# EasyEDA schematic SCH_FC-Hilsha_2025-08-06.json

## Sheets
1 2_XRACER-IMU-R07.schdoc
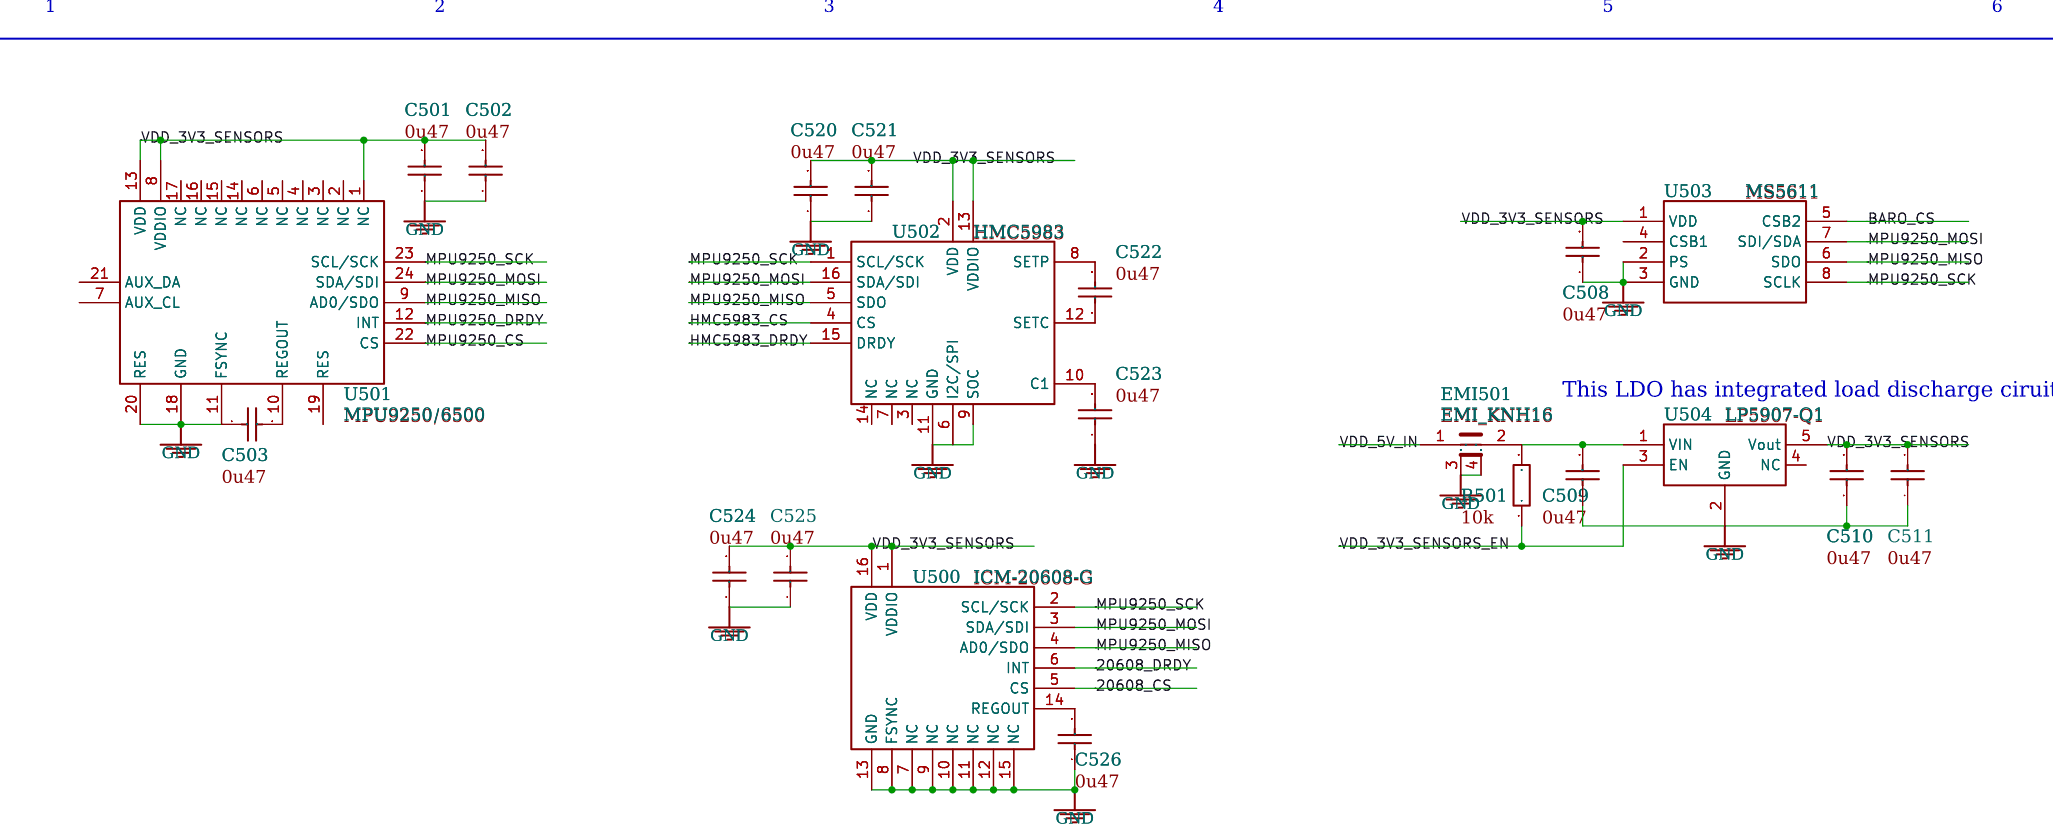
[diagram p0: 2_XRACER-IMU-R07.schdoc]
2 FC Hilsha/XRACER-FMU-R07/XRACER-FMU-R07/1_XRACER-FMU-R07.schdoc
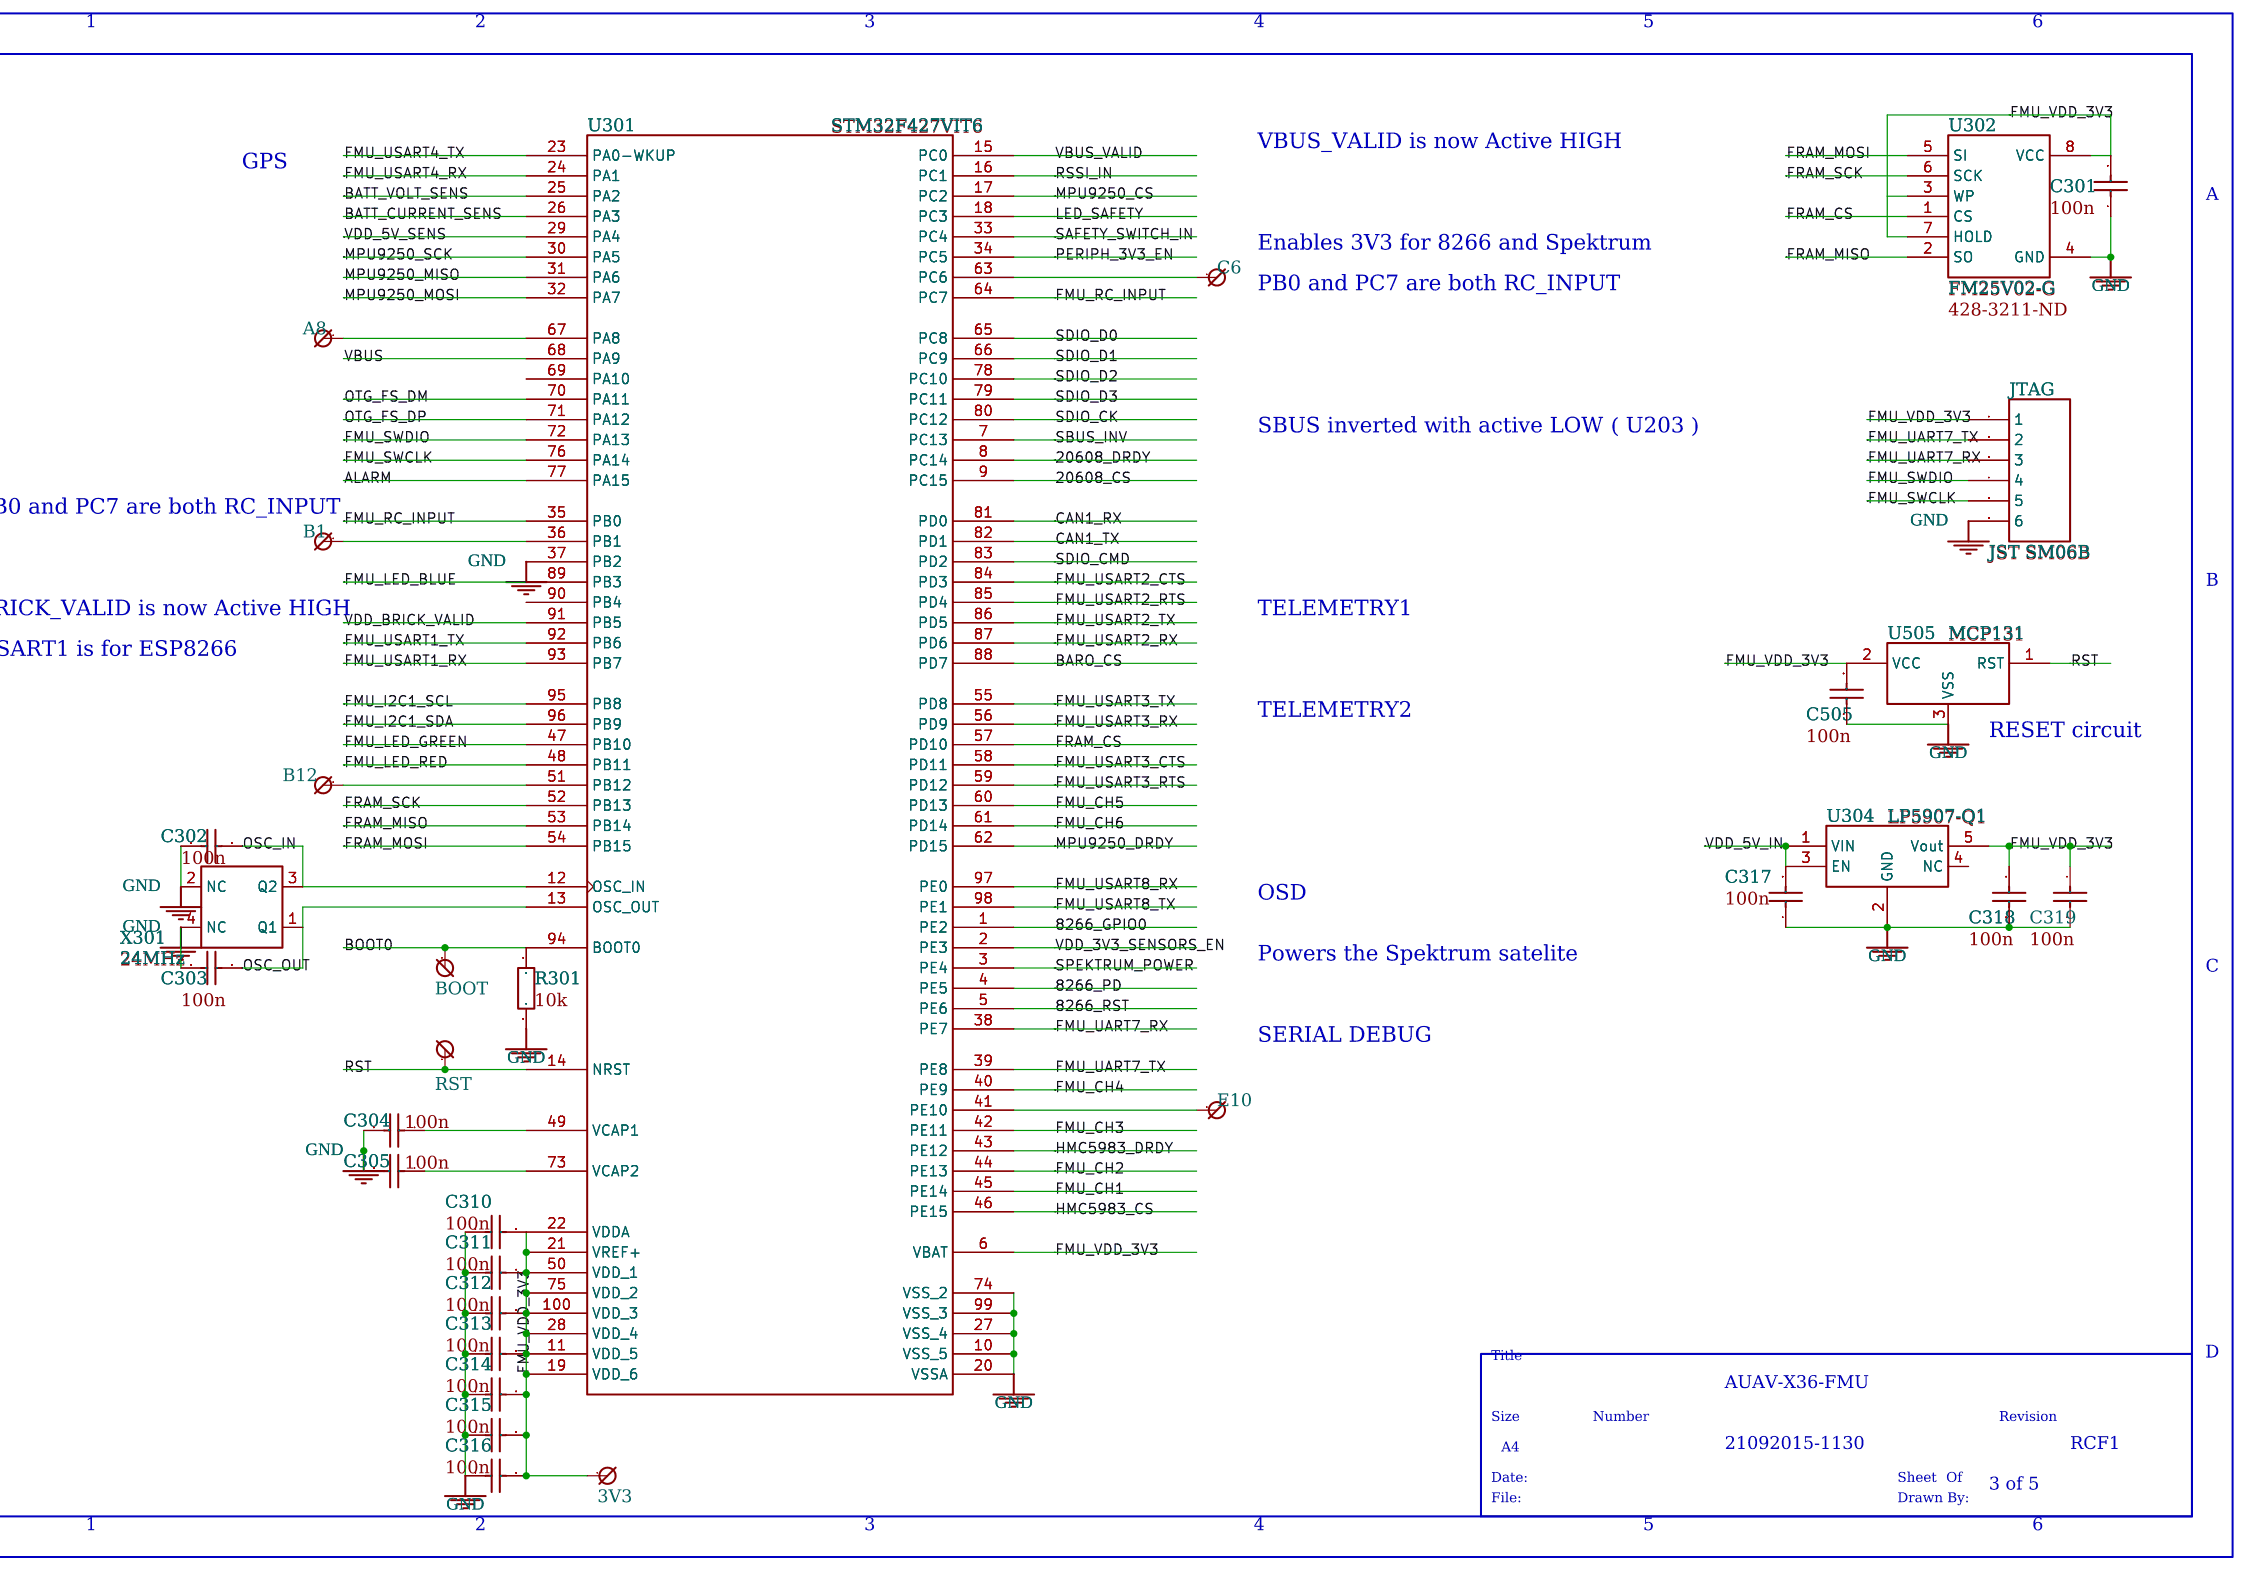
[diagram p1: FC Hilsha/XRACER-FMU-R07/XRACER-FMU-R07/1_XRACER-FMU-R07.schdoc]
3 FC Hilsha/XRACER-FMU-R07/XRACER-FMU-R07/3_XRACER-POWER-R07.schdoc
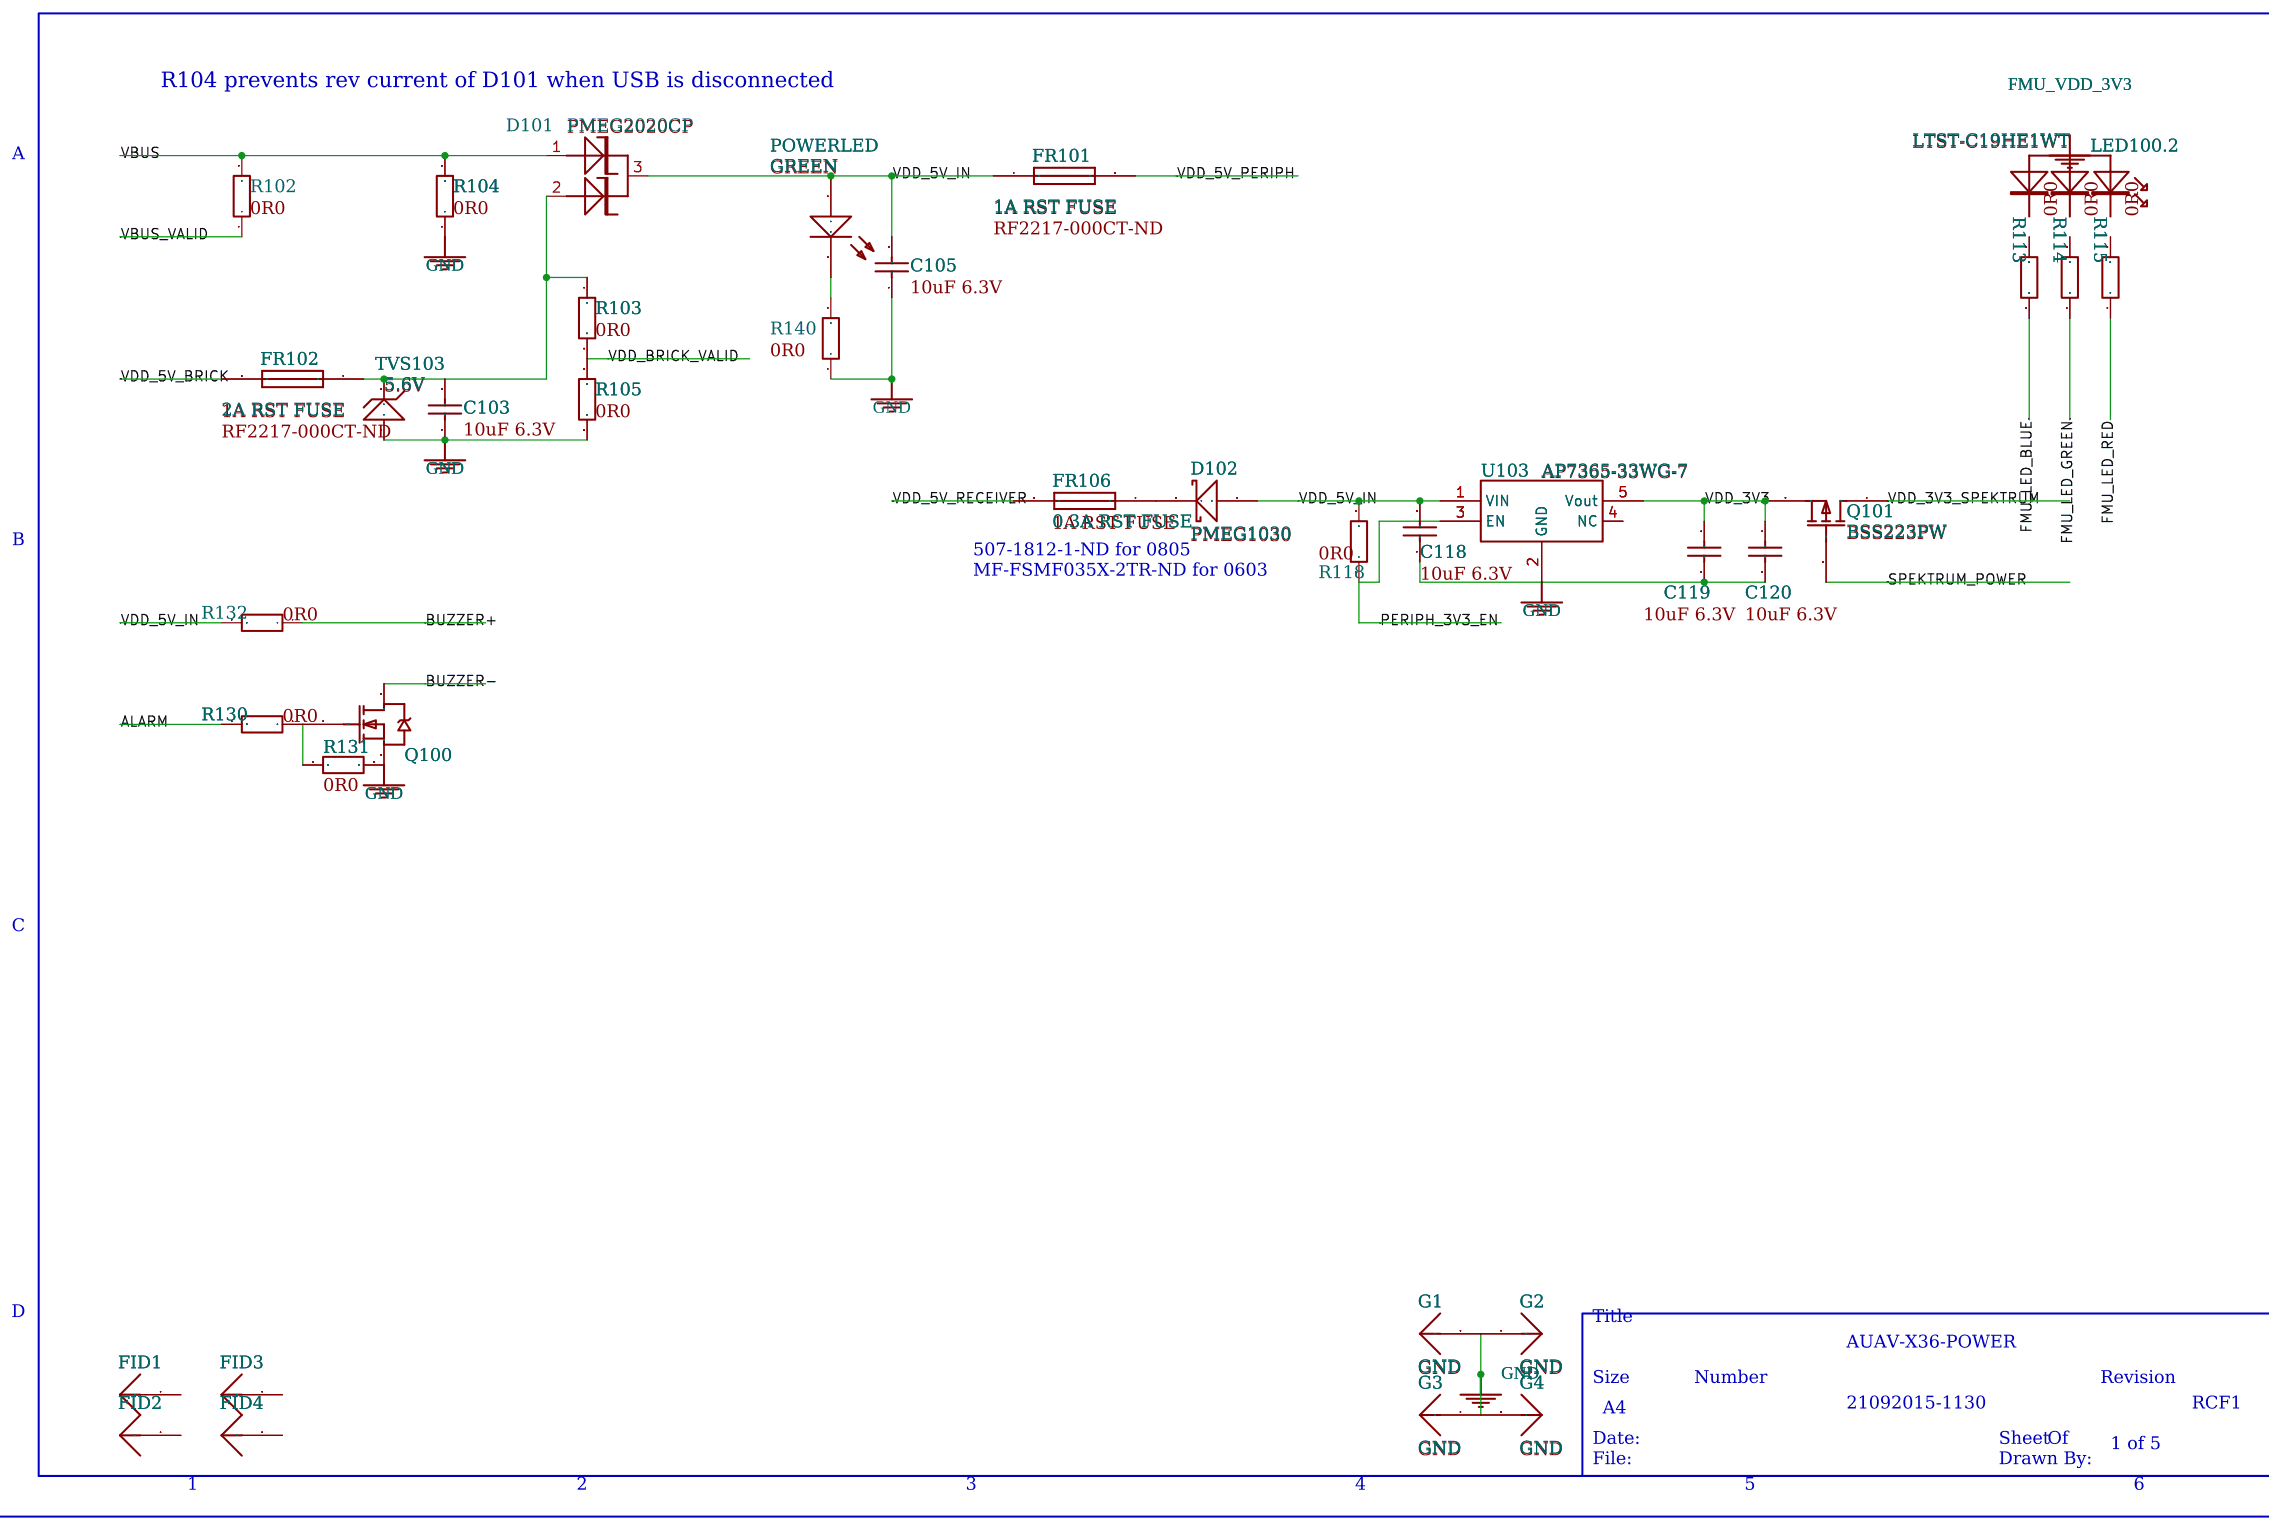
[diagram p2: FC Hilsha/XRACER-FMU-R07/XRACER-FMU-R07/3_XRACER-POWER-R07.schdoc]
4 FC Hilsha/XRACER-FMU-R07/XRACER-FMU-R07/4_XRACER-SD-USB-R07.schdoc
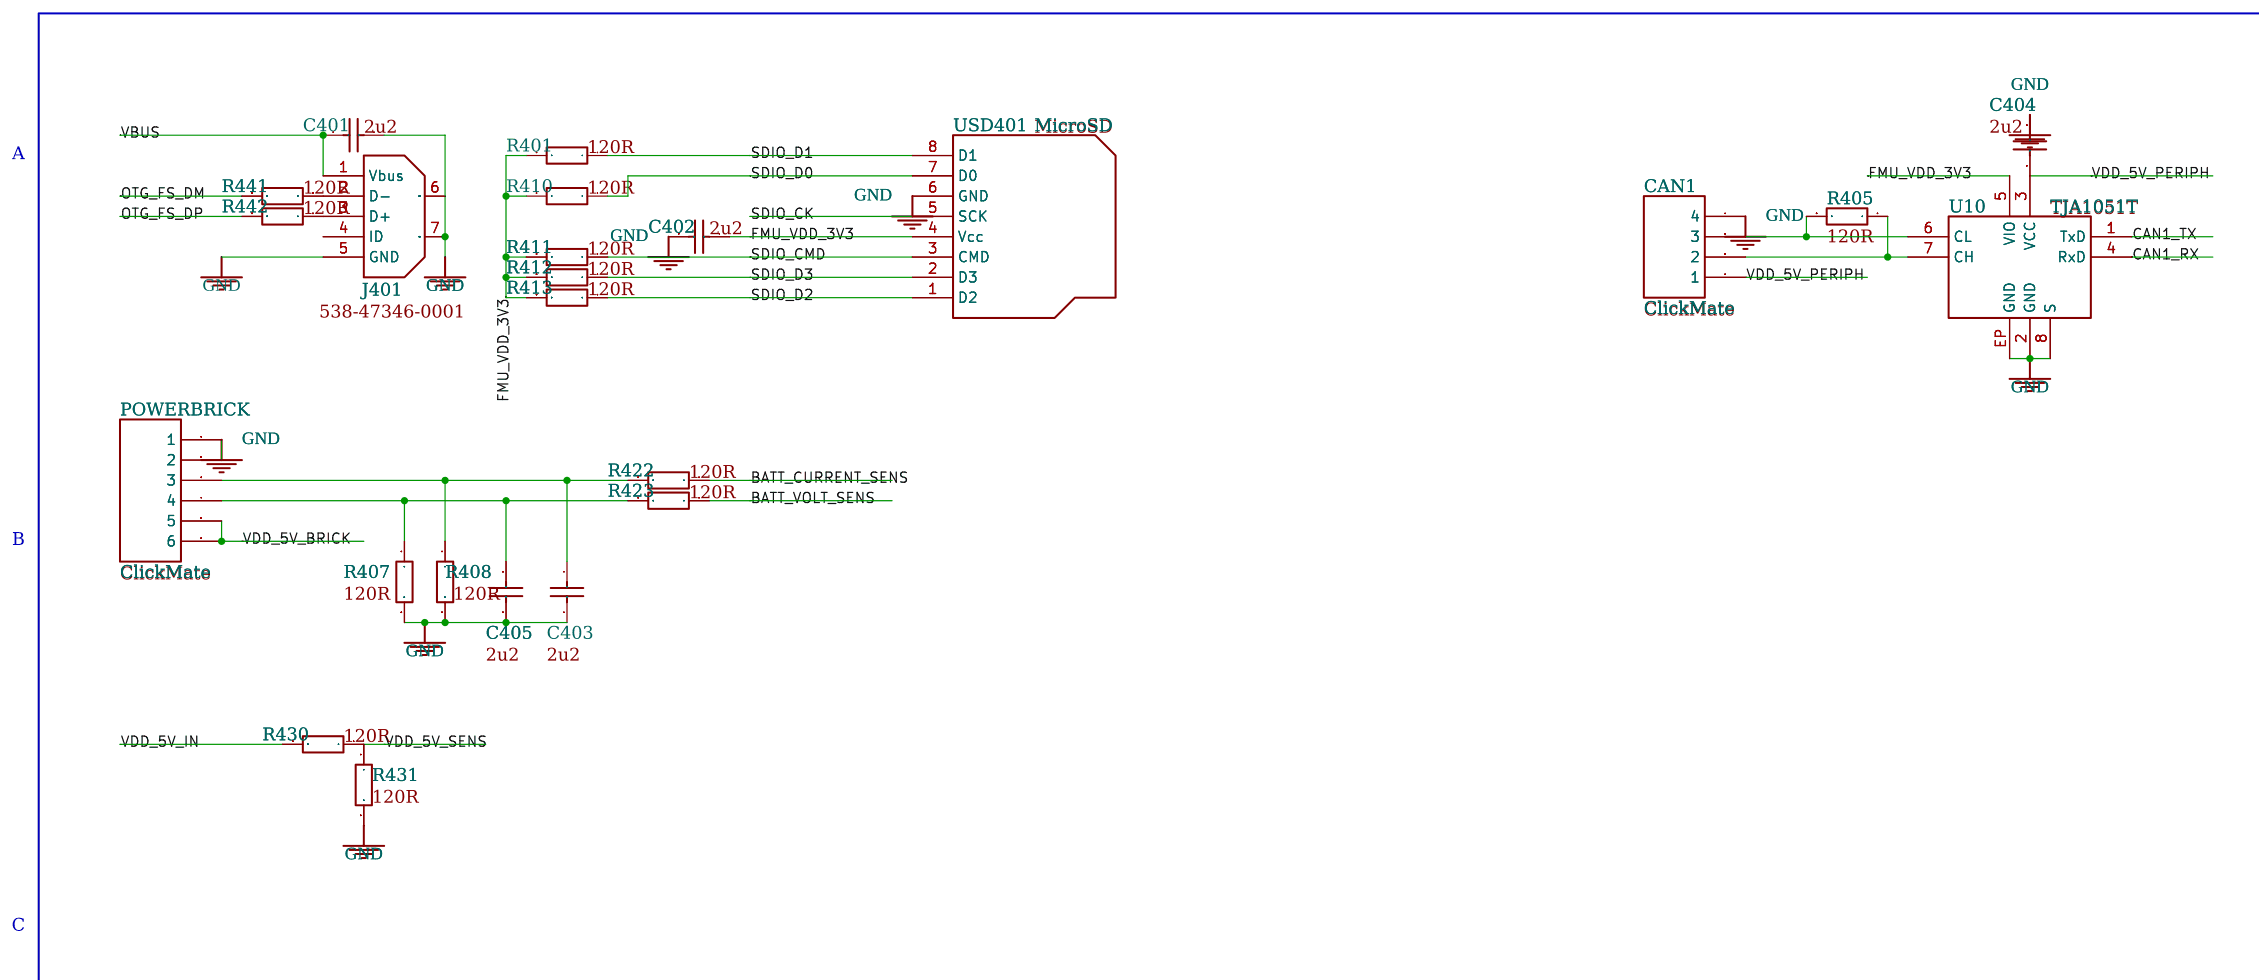
[diagram p3: FC Hilsha/XRACER-FMU-R07/XRACER-FMU-R07/4_XRACER-SD-USB-R07.schdoc]
5 FC Hilsha/XRACER-FMU-R07/XRACER-FMU-R07/5_XRACER-SERIALS-R07.schdoc
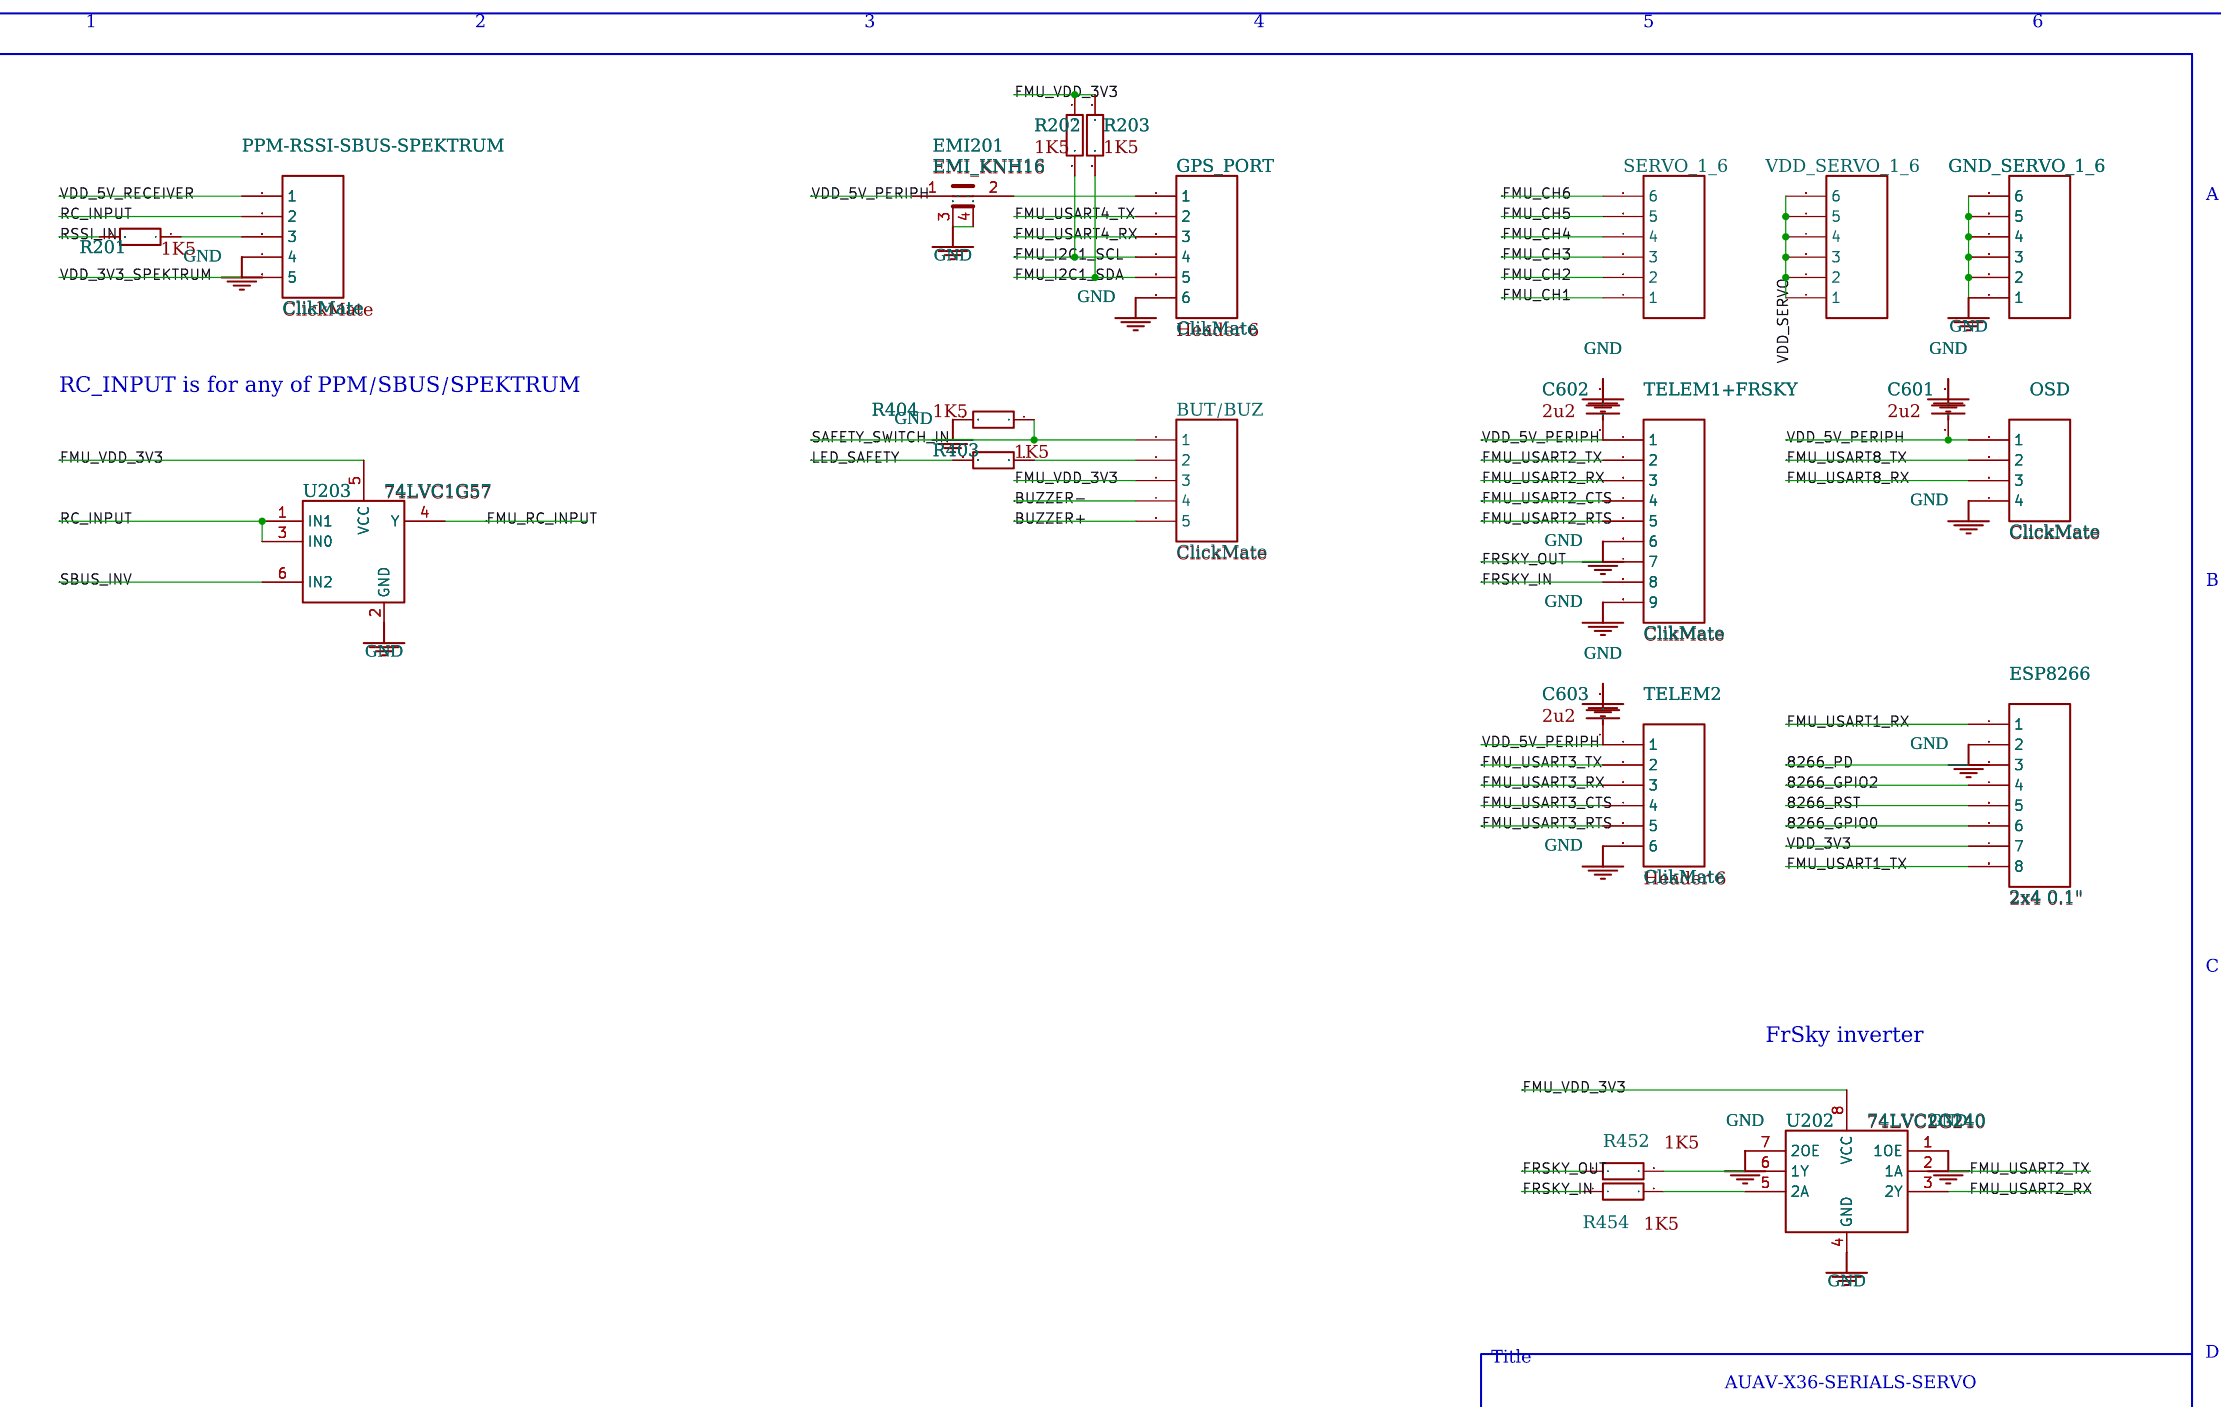
[diagram p4: FC Hilsha/XRACER-FMU-R07/XRACER-FMU-R07/5_XRACER-SERIALS-R07.schdoc]

## Parts
sheet 2_XRACER-IMU-R07.schdoc
C501  100pF  [0402A]
C502  100pF  [0402A]
C503  100pF  [0402A]
C508  100pF  [0402A]
C509  100pF  [0402A]
C510  100pF  [0402A]
C511  100pF  [0402A]
C520  100pF  [0402A]
C521  100pF  [0402A]
C522  100pF  [0402A]
C523  100pF  [0402A]
C524  100pF  [0402A]
C525  100pF  [0402A]
C526  100pF  [0402A]
EMI501  EMI_KNH16  [EMI_KNH16_0603]
R501  1K  [0603A]
U500  ICM-20608-G  [HCLGA-16L]
U501  MPU9250/6500  [MPU6500-9250]
U502  HMC5983  [HMC5883L]
U503  MS5611  [MS5611]
U504  LP5907-Q1  [SOT23-5]
sheet FC Hilsha/XRACER-FMU-R07/XRACER-FMU-R07/1_XRACER-FMU-R07.schdoc
3V3  3V3  [PAD1]
A8  BOOT  [PAD1]
B1  BOOT  [PAD1]
B12  BOOT  [PAD1]
BOOT  BOOT  [PAD1]
C6  BOOT  [PAD1]
C301  100pF  [0402A]
C302  100pF  [0402A]
C303  100pF  [0402A]
C304  100pF  [0402A]
C305  100pF  [0402A]
C310  100pF  [0402A]
C311  100pF  [0402A]
C312  100pF  [0402A]
C313  100pF  [0402A]
C314  100pF  [0402A]
C315  100pF  [0402A]
C316  100pF  [0402A]
C317  100pF  [0402A]
C318  100pF  [0402A]
C319  100pF  [0402A]
C505  100pF  [0402A]
E10  BOOT  [PAD1]
JTAG  JST SM06B  [SM06B-SRSH-TB]
R301  1K  [0402A]
RST  BOOT  [PAD1]
U301  STM32F427VIT6  [LQFP100_L]
U302  FM25V02-G  [SO-8_N]
U304  LP5907-Q1  [SOT23-5]
U505  MCP131  [SOT-323]
X301  24MHz  [CRYSTAL_2.5X2]
sheet FC Hilsha/XRACER-FMU-R07/XRACER-FMU-R07/3_XRACER-POWER-R07.schdoc
C103  100pF  [0603A]
C105  100pF  [0603A]
C118  100pF  [0603A]
C119  100pF  [0603A]
C120  100pF  [0603A]
D101  PMEG2020CP  [PMEG2020CP]
D102  PMEG1030  [SOD323F]
FID1  NO  [SMT_PAD]
FID2  NO  [SMT_PAD]
FID3  NO  [SMT_PAD]
FID4  NO  [SMT_PAD]
FR101  1A RST FUSE  [0805A]
FR102  2A RST FUSE  [0805A]
FR106  0.3A RST FUSE  [0805A]
G1  GND  [SMT_PAD]
G2  GND  [SMT_PAD]
G3  GND  [SMT_PAD]
G4  GND  [SMT_PAD]
LED100  LTST-C19HE1WT  [LTST-C19HE1WT]  (section 2)
POWERLED  GREEN  [0603A]
Q100  DMG1012UW  [2N7002-SOT323]
Q101  BSS223PW  [2N7002-SOT323]
R102  1K  [0402A]
R103  1K  [0402A]
R104  1K  [0402A]
R105  1K  [0402A]
R113  1K  [0402A]
R114  1K  [0402A]
R115  1K  [0402A]
R118  1K  [0402A]
R130  1K  [0402A]
R131  1K  [0402A]
R132  1K  [0402A]
R140  1K  [0402A]
TVS103  5.6V  [SOD323F]
U103  AP7365-33WG-7  [SOT23-5]
sheet FC Hilsha/XRACER-FMU-R07/XRACER-FMU-R07/4_XRACER-SD-USB-R07.schdoc
C401  100pF  [0603A]
C402  100pF  [0603A]
C403  100pF  [0603A]
C404  100pF  [0603A]
C405  100pF  [0603A]
CAN1  ClickMate  [MOLEX_1.25_CLICK_4]
J401  miniUSB  [USBMICRO_B]
POWERBRICK  ClickMate  [MOLEX_CLOK_1.25_6H]
R401  1K  [0603A]
R405  1K  [0603A]
R407  1K  [0603A]
R408  1K  [0603A]
R410  1K  [0603A]
R411  1K  [0603A]
R412  1K  [0603A]
R413  1K  [0603A]
R422  1K  [0603A]
R423  1K  [0603A]
R430  1K  [0603A]
R431  1K  [0603A]
R441  1K  [0603A]
R442  1K  [0603A]
U10  TJA1051T  [8DFN_3X3]
USD401  MicroSD  [MICROSD_CHINA_01]
sheet FC Hilsha/XRACER-FMU-R07/XRACER-FMU-R07/5_XRACER-SERIALS-R07.schdoc
BUT/BUZ  ClickMate  [MOLEX_CLIK_1.25_5H]
C601  100pF  [0402A]
C602  100pF  [0402A]
C603  100pF  [0402A]
EMI201  EMI_KNH16  [EMI_KNH16_0603]
ESP8266  2x4 0.1"  [2.54MM_2X4_SMD_FEMALE]
GND_SERVO_1_6  Header 6  [HDR1X6]
GPS_PORT  ClikMate  [HDR1X6]
OSD  ClickMate  [MOLEX_1.25_CLICK_4]
PPM-RSSI-SBUS-SPEKTRUM  ClikMate  [MOLEX_CLIK_1.25_5H]
R201  1K  [0402A]
R202  1K  [0402A]
R203  1K  [0402A]
R403  1K  [0402A]
R404  1K  [0402A]
R452  1K  [0402A]
R454  1K  [0402A]
SERVO_1_6  Header 6  [HDR1X6]
TELEM1+FRSKY  ClikMate  [MOLEX_CLICK_1.25_9H]
TELEM2  ClikMate  [HDR1X6]
U202  74LVC2G240  [SSOP-8]
U203  74LVC1G57  [SOT323-6]
VDD_SERVO_1_6  Header 6  [HDR1X6]

## Library data of the parts
C501-C503 C520-C522 C524 C525 = -: Symbol: Cap; Device: 0u47; Published: 8-Jun-2000; LatestRevisionDate: 17-Jul-2002; LatestRevisionNote: Re-released for DXP Platform.; PackageReference: RAD-0.3; Publisher: Altium Limited; Origin Footprint 1: 0603A; Add into BOM: yes; Convert to PCB: yes; Design Item ID: Cap; Library Name: Miscellaneous Devices
C508 C526 = -: Symbol: Cap; Device: 0u47; Published: 8-Jun-2000; LatestRevisionDate: 17-Jul-2002; LatestRevisionNote: Re-released for DXP Platform.; PackageReference: RAD-0.3; Publisher: Altium Limited; Add into BOM: yes; Convert to PCB: yes; Design Item ID: Cap; Library Name: Miscellaneous Devices
C509-C511 = -: Symbol: Cap; Device: 0u47; Published: 8-Jun-2000; LatestRevisionDate: 17-Jul-2002; LatestRevisionNote: Re-released for DXP Platform.; PackageReference: RAD-0.3; Publisher: Altium Limited; Add into BOM: yes; Convert to PCB: yes; Origin Footprint: 0603A; Design Item ID: Cap; Library Name: Miscellaneous Devices
C523 = -: Symbol: Cap; Device: 0u47; Published: 8-Jun-2000; LatestRevisionDate: 17-Jul-2002; LatestRevisionNote: Re-released for DXP Platform.; PackageReference: RAD-0.3; Publisher: Altium Limited; Origin Footprint 1: 0603A; Add into BOM: yes; Convert to PCB: yes; Origin Footprint: 0603A; Design Item ID: Cap; Library Name: Miscellaneous Devices
EMI201 EMI501 U304 U500 U502 U504 = -: Add into BOM: yes; Convert to PCB: yes; Library Name: My_Altium
R501 = -: Symbol: Res2; Device: 10k; Published: 8-Jun-2000; LatestRevisionDate: 17-Jul-2002; LatestRevisionNote: Re-released for DXP Platform.; PackageReference: AXIAL-0.4; Publisher: Altium Limited; Add into BOM: yes; Convert to PCB: yes; Design Item ID: Res2; Library Name: Miscellaneous Devices
U501 = -: Symbol: MPU6500; Add into BOM: yes; Convert to PCB: yes; Design Item ID: MPU6500; Library Name: My_Altium
U503 = -: Symbol: MS5611-01BA03; Add into BOM: yes; Convert to PCB: yes; Design Item ID: MS5611-01BA03; Library Name: My_Altium
3V3 = -: Symbol: PLUG; Device: BOOT; Origin Footprint 1: KL1V; Add into BOM: yes; Convert to PCB: yes; Design Item ID: PLUG; Library Name: My_Altium
A8 B1 B12 BOOT C6 E10 RST = -: Symbol: PLUG; Origin Footprint 1: KL1V; Add into BOM: yes; Convert to PCB: yes; Design Item ID: PLUG; Library Name: My_Altium
C301 C304 C305 C310-C316 = -: Symbol: Cap; Device: 100n; Published: 8-Jun-2000; LatestRevisionDate: 17-Jul-2002; LatestRevisionNote: Re-released for DXP Platform.; PackageReference: RAD-0.3; Publisher: Altium Limited; Origin Footprint 1: 0402; Origin Footprint 2: 0603A; Add into BOM: yes; Convert to PCB: yes; Design Item ID: Cap; Library Name: Miscellaneous Devices
C302 C303 = -: Symbol: Cap; Device: 100n; Published: 8-Jun-2000; LatestRevisionDate: 17-Jul-2002; LatestRevisionNote: Re-released for DXP Platform.; PackageReference: RAD-0.3; Publisher: Altium Limited; Origin Footprint 1: 0402; Origin Footprint 2: 0603A; Add into BOM: yes; Convert to PCB: yes; Origin Footprint: 0603A; Design Item ID: Cap; Library Name: Miscellaneous Devices
C317-C319 = -: Symbol: Cap; Device: 100n; Published: 8-Jun-2000; LatestRevisionDate: 17-Jul-2002; LatestRevisionNote: Re-released for DXP Platform.; PackageReference: RAD-0.3; Publisher: Altium Limited; Origin Footprint 1: 0603A; Origin Footprint 2: 0603A; Add into BOM: yes; Convert to PCB: yes; Origin Footprint: 0603A; Design Item ID: Cap; Library Name: Miscellaneous Devices
C505 = -: Symbol: Cap; Device: 100n; Published: 8-Jun-2000; LatestRevisionDate: 17-Jul-2002; LatestRevisionNote: Re-released for DXP Platform.; PackageReference: RAD-0.3; Publisher: Altium Limited; Origin Footprint 1: 0603A; Origin Footprint 2: 0603A; Add into BOM: yes; Convert to PCB: yes; Design Item ID: Cap; Library Name: Miscellaneous Devices
JTAG = -: Symbol: Header 6; LatestRevisionDate: 17-Jul-2002; LatestRevisionNote: Re-released for DXP Platform.; Publisher: Altium Limited; Origin Footprint 1: HDR1X6; Add into BOM: yes; Convert to PCB: yes; Design Item ID: Header 6; Library Name: Miscellaneous Connectors
R301 = -: Symbol: Res2; Device: 10k; Published: 8-Jun-2000; LatestRevisionDate: 17-Jul-2002; LatestRevisionNote: Re-released for DXP Platform.; PackageReference: AXIAL-0.4; Publisher: Altium Limited; PackageDescription: Axial Device, Thru-Hole; 2 Leads; 0.4 in Pin Spacing; Origin Footprint 1: 0603A; Add into BOM: yes; Convert to PCB: yes; Design Item ID: Res2; Library Name: Miscellaneous Devices
U301 = -: Symbol: STM32F103VBT6; Published: 30-May-2008; DatasheetVersion: rev6, Mar-2008; PackageVersion: Mar-2008; PackageReference: LQFP100; Publisher: Altium Limited; PackageDescription: 100-Pin Low-Profile Quad Flat Pack, 14 x 14 mm Body, 0.5 mm Pitch (LQFP100); ComponentLink1Description: Manufacturer Link; ComponentLink1URL: www.st.com/stm32; ComponentLink2Description: Datasheet; ComponentLink2URL: http://www.st.com/stonline/products/literature/ds/13587.pdf; Origin Footprint 1: LQFP100_N; Origin Footprint 2: LQFP100_M; Add into BOM: yes; Convert to PCB: yes; Design Item ID: STM32F103VBT6; Library Name: ST Microcontroller 32-Bit STM32; Datasheet: http://www.st.com/stonline/products/literature/ds/13587.pdf
U302 = -: Symbol: AT45DB161D-MU; Supplier Part Number: 428-3211-ND; Add into BOM: yes; Convert to PCB: yes; Design Item ID: AT45DB161D-MU; Library Name: My_Altium
U505 = -: Symbol: MCP102; Add into BOM: yes; Convert to PCB: yes; Design Item ID: MCP102; Library Name: My_Altium
X301 = -: Symbol: Crystal_4pin; Supplier Part Number: 644-1052-1-ND; Add into BOM: yes; Convert to PCB: yes; Origin Footprint: Crystal_2.5x2; Design Item ID: Crystal_4pin; Library Name: My_Altium
C103 C105 = -: Symbol: Cap; Device: 10uF 6.3V; Published: 8-Jun-2000; LatestRevisionDate: 17-Jul-2002; LatestRevisionNote: Re-released for DXP Platform.; PackageReference: RAD-0.3; Publisher: Altium Limited; PackageDescription: Radial Cap, Thru-Hole; 2 Leads; 0.3 in Pin Spacing; Add into BOM: yes; Convert to PCB: yes; Origin Footprint: 0805A; Design Item ID: Cap; Library Name: Miscellaneous Devices
C118-C120 = -: Symbol: Cap; Device: 10uF 6.3V; Published: 8-Jun-2000; LatestRevisionDate: 17-Jul-2002; LatestRevisionNote: Re-released for DXP Platform.; PackageReference: RAD-0.3; Publisher: Altium Limited; PackageDescription: Radial Cap, Thru-Hole; 2 Leads; 0.3 in Pin Spacing; Add into BOM: yes; Convert to PCB: yes; Design Item ID: Cap; Library Name: Miscellaneous Devices
D101 = -: Add into BOM: yes; Convert to PCB: yes; Origin Footprint: pmeg2020cp; Library Name: My_Altium
D102 = -: Symbol: D Schottky; Published: 8-Jun-2000; LatestRevisionDate: 17-Jul-2002; LatestRevisionNote: Re-released for DXP Platform.; PackageReference: SMB; Publisher: Altium Limited; PackageDescription: DO-214-AA/SMB; 2 C-Bend Leads; Body 5.3 x 3.6 mm, inc. leads (LxW); Code_JEDEC: DO-214-AA; Add into BOM: yes; Convert to PCB: yes; Origin Footprint: sod323f; Design Item ID: D Schottky; Library Name: Miscellaneous Devices
FID1-FID4 = -: Symbol: Plug; Device: GND; LatestRevisionDate: 17-Jul-2002; LatestRevisionNote: Re-released for DXP Platform.; Publisher: Altium Limited; Add into BOM: yes; Convert to PCB: yes; Design Item ID: Plug; Library Name: Miscellaneous Connectors
FR101 = -: Symbol: Fuse 1; Published: 8-Jun-2000; LatestRevisionDate: 17-Jul-2002; LatestRevisionNote: Re-released for DXP Platform.; PackageReference: PIN-W2/E2.8; Publisher: Altium Limited; PackageDescription: Thru-Hole; 2 Leads; DigiKey: RF2217-000CT-ND; Add into BOM: yes; Convert to PCB: yes; Design Item ID: Fuse 1; Library Name: Miscellaneous Devices
FR102 FR106 = -: Symbol: Fuse 1; Device: 1A RST FUSE; Published: 8-Jun-2000; LatestRevisionDate: 17-Jul-2002; LatestRevisionNote: Re-released for DXP Platform.; PackageReference: PIN-W2/E2.8; Publisher: Altium Limited; PackageDescription: Thru-Hole; 2 Leads; DigiKey: RF2217-000CT-ND; Add into BOM: yes; Convert to PCB: yes; Design Item ID: Fuse 1; Library Name: Miscellaneous Devices
G1-G4 = -: Symbol: Plug; LatestRevisionDate: 17-Jul-2002; LatestRevisionNote: Re-released for DXP Platform.; Publisher: Altium Limited; Add into BOM: yes; Convert to PCB: yes; Origin Footprint: Plug; Design Item ID: Plug; Library Name: Miscellaneous Connectors
LED100 = -: Symbol: RGB_LED_5MM; Add into BOM: yes; Convert to PCB: yes; Design Item ID: RGB_LED_5MM; Library Name: My_Altium
POWERLED = -: Symbol: LED0; Published: 8-Jun-2000; LatestRevisionDate: 08-Jul-2005; LatestRevisionNote: Mech Layer 1 removed.; PackageReference: LED-0; Publisher: Altium Limited; PackageDescription: LED; 2 Leads; Add into BOM: yes; Convert to PCB: yes; Design Item ID: LED0; Library Name: Miscellaneous Devices
Q100 = -: Symbol: NMOS-2; Published: 8-Jun-2000; LatestRevisionDate: 17-Jul-2002; LatestRevisionNote: Re-released for DXP Platform.; DatasheetDocument: PD-9.814; PackageReference: TO-220AB; Publisher: Altium Limited; Note: Pin 2 is electrically connected to pin 4.; Code_JEDEC: TO-220-AB; ComponentLink1Description: Manufacturer Link; ComponentLink1URL: http://www.irf.com/; Add into BOM: yes; Convert to PCB: yes; Design Item ID: NMOS-2; Library Name: Miscellaneous Devices
Q101 = -: Symbol: MOSFET-P; Published: 8-Jun-2000; LatestRevisionDate: 17-Jul-2002; LatestRevisionNote: Re-released for DXP Platform.; PackageVersion: 1995/1996; PackageReference: E3; Publisher: Altium Limited; PackageDescription: TO, Flat Index; 3 In-Line, Axial Leads; Body Dia. 4.6mm; Lead Dia. 0.5 mm (max); Add into BOM: yes; Convert to PCB: yes; Design Item ID: MOSFET-P; Library Name: Miscellaneous Devices
R102-R105 R118 R140 = -: Symbol: Res2; Device: 0R0; Published: 8-Jun-2000; LatestRevisionDate: 17-Jul-2002; LatestRevisionNote: Re-released for DXP Platform.; PackageReference: AXIAL-0.4; Publisher: Altium Limited; PackageDescription: Axial Device, Thru-Hole; 2 Leads; 0.4 in Pin Spacing; Origin Footprint 1: 0603A; Origin Footprint 2: 0603A; Add into BOM: yes; Convert to PCB: yes; Origin Footprint: 0603A; Design Item ID: Res2; Library Name: Miscellaneous Devices
R113-R115 = -: Symbol: Res2; Device: 0R0; Published: 8-Jun-2000; LatestRevisionDate: 17-Jul-2002; LatestRevisionNote: Re-released for DXP Platform.; PackageReference: AXIAL-0.4; Publisher: Altium Limited; PackageDescription: Axial Device, Thru-Hole; 2 Leads; 0.4 in Pin Spacing; Origin Footprint 1: AXIAL-0.4; Origin Footprint 2: 0603A; Add into BOM: yes; Convert to PCB: yes; Design Item ID: Res2; Library Name: Miscellaneous Devices
R130-R132 = -: Symbol: Res2; Device: 0R0; Published: 8-Jun-2000; LatestRevisionDate: 17-Jul-2002; LatestRevisionNote: Re-released for DXP Platform.; PackageReference: AXIAL-0.4; Publisher: Altium Limited; PackageDescription: Axial Device, Thru-Hole; 2 Leads; 0.4 in Pin Spacing; Origin Footprint 1: 0603A; Origin Footprint 2: 0603A; Add into BOM: yes; Convert to PCB: yes; Design Item ID: Res2; Library Name: Miscellaneous Devices
TVS103 = -: Symbol: D Zener; Published: 8-Jun-2000; LatestRevisionDate: 17-Jul-2002; LatestRevisionNote: Re-released for DXP Platform.; PackageReference: DIODE-0.7; Publisher: Altium Limited; PackageDescription: Diode, Thru-Hole; 2 Leads; 0.7 in Pin Spacing; Add into BOM: yes; Convert to PCB: yes; Design Item ID: D Zener; Library Name: Miscellaneous Devices
U103 = -: Symbol: LP5907-Q1; Add into BOM: yes; Convert to PCB: yes; Design Item ID: LP5907-Q1; Library Name: My_Altium
C401-C405 = -: Symbol: Cap; Device: 2u2; Published: 8-Jun-2000; LatestRevisionDate: 17-Jul-2002; LatestRevisionNote: Re-released for DXP Platform.; PackageReference: RAD-0.3; Publisher: Altium Limited; Origin Footprint 1: 0402; Add into BOM: yes; Convert to PCB: yes; Design Item ID: Cap; Library Name: Miscellaneous Devices
CAN1 OSD = -: Symbol: Header 4; LatestRevisionDate: 17-Jul-2002; LatestRevisionNote: Re-released for DXP Platform.; Publisher: Altium Limited; Add into BOM: yes; Convert to PCB: yes; Origin Footprint: Molex_1.25_click_4; Design Item ID: Header 4; Library Name: Miscellaneous Connectors
J401 = -: Symbol: MicroUSB; Mouser Part Number: 538-47346-0001; Add into BOM: yes; Convert to PCB: yes; Origin Footprint: USBmicro_B; Design Item ID: MicroUSB; Library Name: My_Altium
POWERBRICK = -: Symbol: Header 6; LatestRevisionDate: 17-Jul-2002; LatestRevisionNote: Re-released for DXP Platform.; Publisher: Altium Limited; Origin Footprint 1: HDR1X6; Add into BOM: yes; Convert to PCB: yes; Origin Footprint: Molex_Clok_1.25_6H; Design Item ID: Header 6; Library Name: Miscellaneous Connectors
R401 R407 R408 R410-R413 R422 R423 R430 R431 R441 R442 = -: Symbol: Res2; Device: 120R; Published: 8-Jun-2000; LatestRevisionDate: 17-Jul-2002; LatestRevisionNote: Re-released for DXP Platform.; PackageReference: AXIAL-0.4; Publisher: Altium Limited; PackageDescription: Axial Device, Thru-Hole; 2 Leads; 0.4 in Pin Spacing; Add into BOM: yes; Convert to PCB: yes; Origin Footprint: 0402A; Design Item ID: Res2; Library Name: Miscellaneous Devices
R405 = -: Symbol: Res2; Device: 120R; Published: 8-Jun-2000; LatestRevisionDate: 17-Jul-2002; LatestRevisionNote: Re-released for DXP Platform.; PackageReference: AXIAL-0.4; Publisher: Altium Limited; PackageDescription: Axial Device, Thru-Hole; 2 Leads; 0.4 in Pin Spacing; Origin Footprint 1: 0603; Add into BOM: yes; Convert to PCB: yes; Design Item ID: Res2; Library Name: Miscellaneous Devices
U10 = -: Add into BOM: yes; Convert to PCB: yes; Origin Footprint: 8DFN_3x3; Library Name: My_Altium
USD401 = -: Add into BOM: yes; Convert to PCB: yes; Origin Footprint: MicroSD_China_01; Library Name: My_Altium
BUT/BUZ = -: Symbol: Header 5; LatestRevisionDate: 17-Jul-2002; LatestRevisionNote: Re-released for DXP Platform.; Publisher: Altium Limited; Origin Footprint 1: HDR1X5; Add into BOM: yes; Convert to PCB: yes; Origin Footprint: Molex_Clik_1.25_5H; Design Item ID: Header 5; Library Name: Miscellaneous Connectors
C601-C603 = -: Symbol: Cap; Device: 2u2; Published: 8-Jun-2000; LatestRevisionDate: 17-Jul-2002; LatestRevisionNote: Re-released for DXP Platform.; PackageReference: RAD-0.3; Publisher: Altium Limited; Origin Footprint 1: 0603A; Add into BOM: yes; Convert to PCB: yes; Design Item ID: Cap; Library Name: Miscellaneous Devices
ESP8266 = -: Symbol: Header 8; LatestRevisionDate: 17-Jul-2002; LatestRevisionNote: Re-released for DXP Platform.; Publisher: Altium Limited; Add into BOM: yes; Convert to PCB: yes; Origin Footprint: 2.54mm_2x4_SMD_female; Design Item ID: Header 8; Library Name: Miscellaneous Connectors
GND_SERVO_1_6 SERVO_1_6 VDD_SERVO_1_6 = -: LatestRevisionDate: 17-Jul-2002; LatestRevisionNote: Re-released for DXP Platform.; Publisher: Altium Limited; Add into BOM: yes; Convert to PCB: yes; Library Name: Miscellaneous Connectors
GPS_PORT TELEM2 = -: Symbol: Header 6; Device: Header 6; LatestRevisionDate: 17-Jul-2002; LatestRevisionNote: Re-released for DXP Platform.; Publisher: Altium Limited; Add into BOM: yes; Convert to PCB: yes; Origin Footprint: Molex_Clok_1.25_6H; Design Item ID: Header 6; Library Name: Miscellaneous Connectors
PPM-RSSI-SBUS-SPEKTRUM = -: Symbol: Header 5; Device: ClickMate; LatestRevisionDate: 17-Jul-2002; LatestRevisionNote: Re-released for DXP Platform.; Publisher: Altium Limited; Origin Footprint 1: HDR1X5; Add into BOM: yes; Convert to PCB: yes; Origin Footprint: Molex_Clik_1.25_5H; Design Item ID: Header 5; Library Name: Miscellaneous Connectors
R201-R203 R403 R404 = -: Symbol: Res2; Device: 1K5; Published: 8-Jun-2000; LatestRevisionDate: 17-Jul-2002; LatestRevisionNote: Re-released for DXP Platform.; PackageReference: AXIAL-0.4; Publisher: Altium Limited; PackageDescription: Axial Device, Thru-Hole; 2 Leads; 0.4 in Pin Spacing; Origin Footprint 1: 0402; Add into BOM: yes; Convert to PCB: yes; Design Item ID: Res2; Library Name: Miscellaneous Devices
R452 R454 = -: Symbol: Res2; Device: 1K5; Published: 8-Jun-2000; LatestRevisionDate: 17-Jul-2002; LatestRevisionNote: Re-released for DXP Platform.; PackageReference: AXIAL-0.4; Publisher: Altium Limited; PackageDescription: Axial Device, Thru-Hole; 2 Leads; 0.4 in Pin Spacing; Origin Footprint 1: 0603A; Add into BOM: yes; Convert to PCB: yes; Design Item ID: Res2; Library Name: Miscellaneous Devices
TELEM1+FRSKY = -: Symbol: Header 9; LatestRevisionDate: 17-Jul-2002; LatestRevisionNote: Re-released for DXP Platform.; Publisher: Altium Limited; Add into BOM: yes; Convert to PCB: yes; Origin Footprint: Molex_Click_1.25_9H; Design Item ID: Header 9; Library Name: Miscellaneous Connectors
U202 = -: Add into BOM: yes; Convert to PCB: yes; Origin Footprint: ssop-8; Library Name: My_Altium
U203 = -: Add into BOM: yes; Convert to PCB: yes; Origin Footprint: sot323-6; Library Name: My_Altium

## Nets
GND: C103.1 C105.1 C118.1 C119.1 C120.1 C301.1 C302.1 C303.1 C304.2 C305.2 C310.1 C311.1 C312.1 C313.1 C314.1 C315.1 C316.1 C317.1 C318.1 C319.1 C401.1 C402.2 C403.2 C404.1 C405.2 C501.1 C502.1 C503.1 C505.1 C508.1 C509.1 C510.1 C511.1 C520.1 C521.1 C523.1 C524.1 C525.1 C526.1 C601.2 C602.2 C603.2 CAN1.4 EMI201.3(G) EMI201.4(G) EMI501.3(G) EMI501.4(G) ESP8266.2 G1.1 G2.1 G3.1 G4.1 GND_SERVO_1_6.1 GND_SERVO_1_6.2 GND_SERVO_1_6.3 GND_SERVO_1_6.4 GND_SERVO_1_6.5 GND_SERVO_1_6.6 GPS_PORT.6 J401.5(GND) J401.6(GND) J401.7(GND) JTAG.6 OSD.4 POWERBRICK.1 POWERBRICK.2 PPM-RSSI-SBUS-SPEKTRUM.4 Q100.2(S) R104.1 R105.2 R131.2 R140.1 R301.2 R404.2 R407.2 R408.2 R431.2 TELEM1+FRSKY.6 TELEM1+FRSKY.9 TELEM2.6 TVS103.1(A) U10.2(GND) U10.8(S) U10.EP(GND) U103.2(GND) U202.1(1OE) U202.4(GND) U202.7(2OE) U203.2(GND) U301.10(VSS_5) U301.20(VSSA) U301.27(VSS_4) U301.37(PB2) U301.74(VSS_2) U301.99(VSS_3) U302.4(GND) U304.2(GND) U500.7(NC) U500.8(FSYNC) U500.9(NC) U500.10(NC) U500.11(NC) U500.12(NC) U500.13(GND) U500.15(NC) U501.11(FSYNC) U501.18(GND) U501.20(RES) U502.6(I2C/SPI) U502.9(SOC) U502.11(GND) U503.2(PS) U503.3(GND) U504.2(GND) U505.3(VSS) USD401.6(GND) X301.2(NC) X301.4(NC)
VBUS: C401.2 D101.1 J401.1(Vbus) R102.2 R104.2 U301.68(PA9)
VBUS_VALID: R102.1 U301.15(PC0)
VDD_3V3: C119.2 C120.2 ESP8266.7 Q101.2(S) U103.5(Vout)
VDD_3V3_SENSORS: C501.2 C502.2 C508.2 C510.2 C511.2 C520.2 C521.2 C524.2 C525.2 U500.1(VDDIO) U500.16(VDD) U501.1(NC) U501.8(VDDIO) U501.13(VDD) U502.2(VDD) U502.13(VDDIO) U503.1(VDD) U504.5(Vout)
VDD_3V3_SENSORS_EN: R501.1 U301.2(PE3) U504.3(EN)
VDD_3V3_SPEKTRUM: PPM-RSSI-SBUS-SPEKTRUM.5 Q101.1(D)
VDD_5V_BRICK: FR102.1 POWERBRICK.5 POWERBRICK.6
VDD_5V_IN: C105.2 C118.2 C317.2 D101.3 D102.1(A) EMI501.1(L1) FR101.1 POWERLED.1(A) R118.2 R132.2 R430.2 U103.1(VIN) U304.1(VIN) U304.3(EN)
VDD_5V_PERIPH: C404.2 C601.1 C602.1 C603.1 CAN1.1 EMI201.1(L1) FR101.2 OSD.1 TELEM1+FRSKY.1 TELEM2.1 U10.3(VCC)
VDD_5V_RECEIVER: FR106.2 PPM-RSSI-SBUS-SPEKTRUM.1
VDD_5V_SENS: R430.1 R431.1 U301.29(PA4)
VDD_BRICK_VALID: R103.2 R105.1 U301.91(PB5)
VDD_SERVO: VDD_SERVO_1_6.1 VDD_SERVO_1_6.2 VDD_SERVO_1_6.3 VDD_SERVO_1_6.4 VDD_SERVO_1_6.5 VDD_SERVO_1_6.6
8266_GPIO0: ESP8266.6 U301.1(PE2)
8266_GPIO2: ESP8266.4
8266_PD: ESP8266.3 U301.4(PE5)
8266_RST: ESP8266.5 U301.5(PE6)
20608_CS: U301.9(PC15) U500.5(CS)
20608_DRDY: U301.8(PC14) U500.6(INT)
ALARM: R130.2 U301.77(PA15)
BARO_CS: U301.88(PD7) U503.5(CSB2)
BATT_CURRENT_SENS: R422.1 U301.26(PA3)
BATT_VOLT_SENS: R423.1 U301.25(PA2)
BOOT0: BOOT.1 R301.1 U301.94(BOOT0)
BUZZER+: BUT/BUZ.5 R132.1
BUZZER-: BUT/BUZ.4 Q100.1(D)
CAN1_RX: U10.4(RxD) U301.81(PD0)
CAN1_TX: U10.1(TxD) U301.82(PD1)
FMU_CH1: SERVO_1_6.1 U301.45(PE14)
FMU_CH2: SERVO_1_6.2 U301.44(PE13)
FMU_CH3: SERVO_1_6.3 U301.42(PE11)
FMU_CH4: SERVO_1_6.4 U301.40(PE9)
FMU_CH5: SERVO_1_6.5 U301.60(PD13)
FMU_CH6: SERVO_1_6.6 U301.61(PD14)
FMU_I2C1_SCL: GPS_PORT.4 R202.2 U301.95(PB8)
FMU_I2C1_SDA: GPS_PORT.5 R203.2 U301.96(PB9)
FMU_LED_BLUE: R113.1 U301.89(PB3)
FMU_LED_GREEN: R114.1 U301.47(PB10)
FMU_LED_RED: R115.1 U301.48(PB11)
FMU_RC_INPUT: U203.4(Y) U301.35(PB0) U301.64(PC7)
FMU_SWCLK: JTAG.5 U301.76(PA14)
FMU_SWDIO: JTAG.4 U301.72(PA13)
FMU_UART7_RX: JTAG.3 U301.38(PE7)
FMU_UART7_TX: JTAG.2 U301.39(PE8)
FMU_USART1_RX: ESP8266.1 U301.93(PB7)
FMU_USART1_TX: ESP8266.8 U301.92(PB6)
FMU_USART2_CTS: TELEM1+FRSKY.4 U301.84(PD3)
FMU_USART2_RTS: TELEM1+FRSKY.5 U301.85(PD4)
FMU_USART2_RX: TELEM1+FRSKY.3 U202.3(2Y) U301.87(PD6)
FMU_USART2_TX: TELEM1+FRSKY.2 U202.2(1A) U301.86(PD5)
FMU_USART3_CTS: TELEM2.4 U301.58(PD11)
FMU_USART3_RTS: TELEM2.5 U301.59(PD12)
FMU_USART3_RX: TELEM2.3 U301.56(PD9)
FMU_USART3_TX: TELEM2.2 U301.55(PD8)
FMU_USART4_RX: GPS_PORT.3 U301.24(PA1)
FMU_USART4_TX: GPS_PORT.2 U301.23(PA0-WKUP)
FMU_USART8_RX: OSD.3 U301.97(PE0)
FMU_USART8_TX: OSD.2 U301.98(PE1)
FMU_VDD_3V3: 3V3.1 BUT/BUZ.3 C301.2 C310.2 C311.2 C312.2 C313.2 C314.2 C315.2 C316.2 C318.2 C319.2 C402.1 C505.2 JTAG.1 R202.1 R203.1 R401.2 R410.2 R411.2 R412.2 R413.2 U10.5(VIO) U202.8(VCC) U203.5(VCC) U301.6(VBAT) U301.11(VDD_5) U301.19(VDD_6) U301.21(VREF+) U301.22(VDDA) U301.28(VDD_4) U301.50(VDD_1) U301.75(VDD_2) U301.100(VDD_3) U302.3(WP) U302.7(HOLD) U302.8(VCC) U304.5(Vout) U505.2(VCC) USD401.4(Vcc)
FRAM_CS: U301.57(PD10) U302.1(CS)
FRAM_MISO: U301.53(PB14) U302.2(SO)
FRAM_MOSI: U301.54(PB15) U302.5(SI)
FRAM_SCK: U301.52(PB13) U302.6(SCK)
FRSKY_IN: R454.1 TELEM1+FRSKY.8
FRSKY_OUT: R452.1 TELEM1+FRSKY.7
HMC5983_CS: U301.46(PE15) U502.4(CS)
HMC5983_DRDY: U301.43(PE12) U502.15(DRDY)
LED_SAFETY: R403.2 U301.18(PC3)
MPU9250_CS: U301.17(PC2) U501.22(CS)
MPU9250_DRDY: U301.62(PD15) U501.12(INT)
MPU9250_MISO: U301.31(PA6) U500.4(AD0/SDO) U501.9(AD0/SDO) U502.5(SDO) U503.6(SDO)
MPU9250_MOSI: U301.32(PA7) U500.3(SDA/SDI) U501.24(SDA/SDI) U502.16(SDA/SDI) U503.7(SDI/SDA)
MPU9250_SCK: U301.30(PA5) U500.2(SCL/SCK) U501.23(SCL/SCK) U502.1(SCL/SCK) U503.8(SCLK)
OSC_IN: C302.2 U301.12(OSC_IN) X301.3(Q2)
OSC_OUT: C303.2 U301.13(OSC_OUT) X301.1(Q1)
OTG_FS_DM: R441.2 U301.70(PA11)
OTG_FS_DP: R442.2 U301.71(PA12)
PERIPH_3V3_EN: R118.1 U103.3(EN) U301.34(PC5)
RC_INPUT: PPM-RSSI-SBUS-SPEKTRUM.2 U203.1(IN1) U203.3(IN0)
RSSI_IN: R201.2 U301.16(PC1)
RST: RST.1 U301.14(NRST) U505.1(RST)
SAFETY_SWITCH_IN: BUT/BUZ.1 R404.1 U301.33(PC4)
SBUS_INV: U203.6(IN2) U301.7(PC13)
SDIO_CK: U301.80(PC12) USD401.5(SCK)
SDIO_CMD: R411.1 U301.83(PD2) USD401.3(CMD)
SDIO_D0: R410.1 U301.65(PC8) USD401.7(D0)
SDIO_D1: R401.1 U301.66(PC9) USD401.8(D1)
SDIO_D2: R413.1 U301.78(PC10) USD401.1(D2)
SDIO_D3: R412.1 U301.79(PC11) USD401.2(D3)
SPEKTRUM_POWER: Q101.3(G) U301.3(PE4)
Net-(A8-1): A8.1 U301.67(PA8)
Net-(B1-1): B1.1 U301.36(PB1)
Net-(B12-1): B12.1 U301.51(PB12)
Net-(BUT/BUZ-2): BUT/BUZ.2 R403.1
Net-(C6-1): C6.1 U301.63(PC6)
Net-(C103-2): C103.2 D101.2 FR102.2 R103.1 TVS103.2(K)
Net-(C304-1): C304.1 U301.49(VCAP1)
Net-(C305-1): C305.1 U301.73(VCAP2)
Net-(C403-1): C403.1 POWERBRICK.3 R408.1 R422.2
Net-(C405-1): C405.1 POWERBRICK.4 R407.1 R423.2
Net-(C503-2): C503.2 U501.10(REGOUT)
Net-(C509-2): C509.2 EMI501.2(L2) R501.2 U504.1(VIN)
Net-(C522-1): C522.1 U502.12(SETC)
Net-(C522-2): C522.2 U502.8(SETP)
Net-(C523-2): C523.2 U502.10(C1)
Net-(C526-2): C526.2 U500.14(REGOUT)
Net-(CAN1-2): CAN1.2 R405.1 U10.7(CH)
Net-(CAN1-3): CAN1.3 R405.2 U10.6(CL)
Net-(D102-2): D102.2(K) FR106.1
Net-(E10-1): E10.1 U301.41(PE10)
Net-(EMI201-2): EMI201.2(L2) GPS_PORT.1
Net-(J401-2): J401.2(D-) R441.1
Net-(J401-3): J401.3(D+) R442.1
Net-(POWERLED-2): POWERLED.2(K) R140.2
Net-(PPM-RSSI-SBUS-SPEKTRUM-3): PPM-RSSI-SBUS-SPEKTRUM.3 R201.1
Net-(Q100-3): Q100.3(G) R130.1 R131.1
Net-(R452-2): R452.2 U202.6(1Y)
Net-(R454-2): R454.2 U202.5(2A)

Not connected (* = marked no-connect by the designer): FID1 1; FID2 1; FID3 1; FID4 1; J401 4(ID); R113 2; R114 2; R115 2; U103 4(NC); U301 69(PA10) 90(PB4); U304 4(NC); U501 2(NC) 3(NC) 4(NC) 5(NC) 6(NC) 7(AUX_CL) 14(NC) 15(NC) 16(NC) 17(NC) 19(RES) 21(AUX_DA); U502 3(NC) 7(NC) 14(NC); U503 4(CSB1); U504 4(NC)

## Notes on the sheets
sheet 1
- 1
- 2
- 3
- 4
- 5
- 6
- A
- A
- This LDO has integrated load discharge ciruit
- B
- B
- C
- C
- D
- Title
- D
- AUAV-X36-IMU
- Size
- Number
- Revision
- 21092015-1130
- RCF1
- A4
- Date:
- Sheet
- Of
- 5 of 5
- File:
- Drawn By:
- 1
- 2
- 3
- 4
- 5
- 6
sheet 2
- 1
- 2
- 3
- 4
- 5
- 6
- VBUS_VALID is now Active HIGH
- GPS
- A
- A
- Enables 3V3 for 8266 and Spektrum
- PB0 and PC7 are both RC_INPUT
- SBUS inverted with active LOW ( U203 )
- PB0 and PC7 are both RC_INPUT
- B
- B
- BRICK_VALID is now Active HIGH
- TELEMETRY1
- USART1 is for ESP8266
- TELEMETRY2
- RESET circuit
- OSD
- C
- Powers the Spektrum satelite
- C
- SERIAL DEBUG
- D
- D
- Title
- AUAV-X36-FMU
- Size
- Number
- Revision
- A4
- 21092015-1130
- RCF1
- Date:
- Sheet
- Of
- 3 of 5
- File:
- Drawn By:
- 1
- 2
- 3
- 4
- 5
- 6
sheet 3
- 1
- 2
- 3
- 4
- 5
- 6
- R104 prevents rev current of D101 when USB is disconnected
- A
- A
- B
- 507-1812-1-ND for 0805
- B
- MF-FSMF035X-2TR-ND for 0603
- C
- C
- D
- Title
- D
- AUAV-X36-POWER
- Size
- Number
- Revision
- A4
- 21092015-1130
- RCF1
- Date:
- Sheet
- Of
- 1 of 5
- File:
- Drawn By:
- 1
- 2
- 3
- 4
- 5
- 6
sheet 4
- 1
- 2
- 3
- 4
- 5
- 6
- A
- A
- B
- B
- C
- C
- D
- Title
- D
- AUAV-X36-SD-USB-I2C-CAN
- Size
- Number
- Revision
- A4
- 21092015-1130
- RCF2
- Date:
- Sheet
- Of
- 4 of 5
- File:
- Drawn By:
- 1
- 2
- 3
- 4
- 5
- 6
sheet 5
- 1
- 2
- 3
- 4
- 5
- 6
- A
- A
- RC_INPUT is for any of PPM/SBUS/SPEKTRUM
- B
- B
- C
- C
- FrSky inverter
- D
- D
- Title
- AUAV-X36-SERIALS-SERVO
- Size
- Number
- Revision
- A4
- 21092015-1130
- RCF1
- Date:
- Sheet
- Of
- 2 of 5
- File:
- Drawn By:
- 1
- 2
- 3
- 4
- 5
- 6
